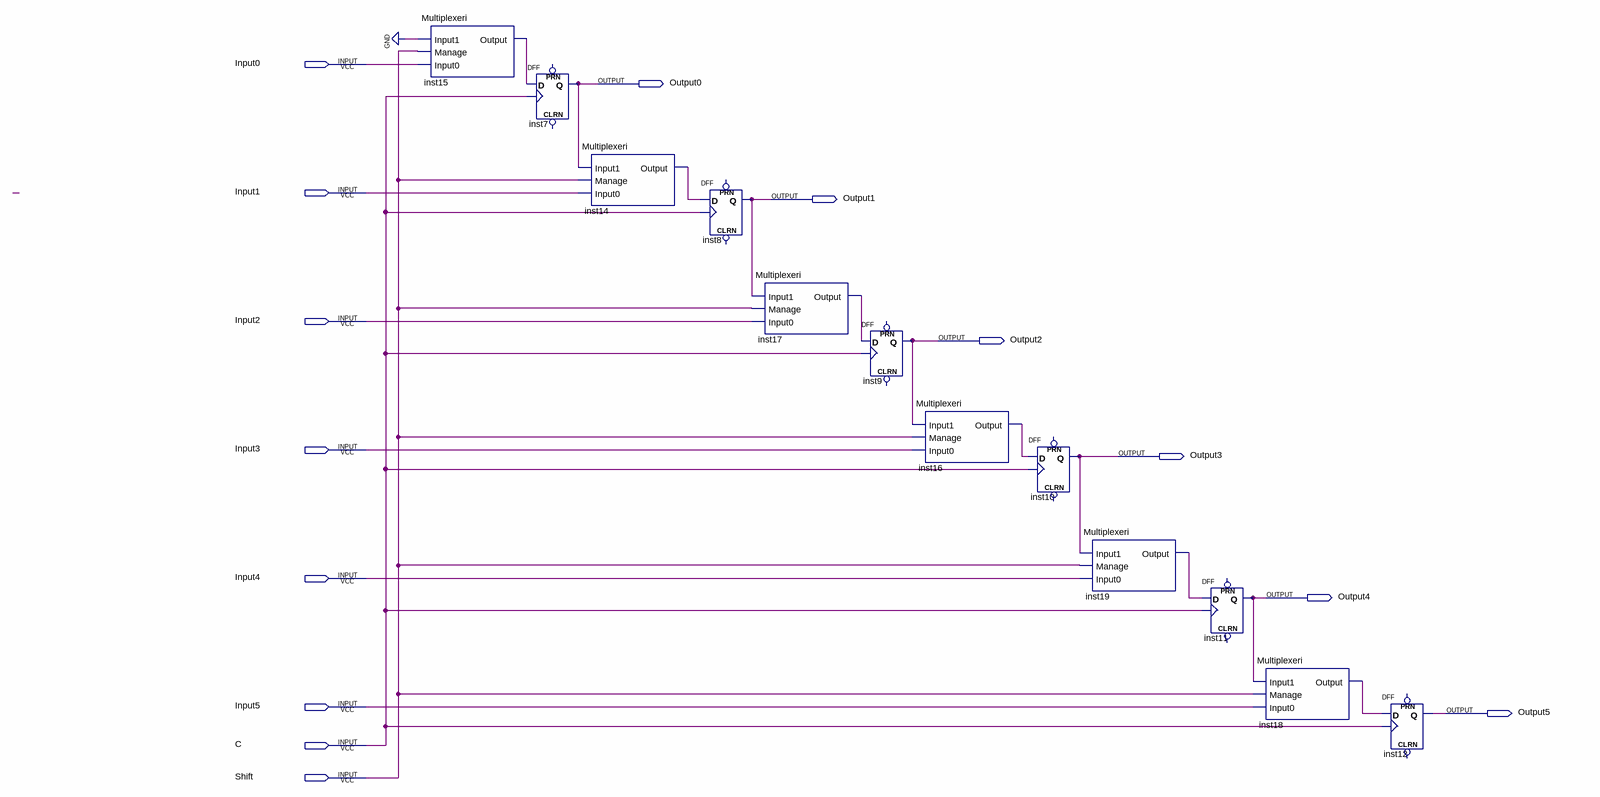
[diagram p0: schematic sheet]
// Quartus schematic Lab_1.bdf as structural Verilog: 12 symbols, 14 pins
module Lab_1 (
  input  Input0,
  input  Input1,
  input  Input2,
  input  Input3,
  input  Input4,
  input  Input5,
  input  C,
  input  Shift,
  output Output0,
  output Output1,
  output Output2,
  output Output3,
  output Output4,
  output Output5
);

  wire inst14_output, inst15_output, inst16_output, inst17_output, inst18_output, inst19_output;

  Multiplexeri inst15 (.Input1(1'b0), .Manage(Shift), .Input0(Input0), .Output(inst15_output));
  DFF inst7 (.CLK(C), .D(inst15_output), .Q(Output0));  // open: CLRN, PRN
  Multiplexeri inst14 (.Input1(Output0), .Manage(Shift), .Input0(Input1), .Output(inst14_output));
  DFF inst8 (.CLK(C), .D(inst14_output), .Q(Output1));  // open: CLRN, PRN
  Multiplexeri inst17 (.Input1(Output1), .Manage(Shift), .Input0(Input2), .Output(inst17_output));
  DFF inst9 (.CLK(C), .D(inst17_output), .Q(Output2));  // open: CLRN, PRN
  Multiplexeri inst16 (.Input1(Output2), .Manage(Shift), .Input0(Input3), .Output(inst16_output));
  DFF inst10 (.CLK(C), .D(inst16_output), .Q(Output3));  // open: CLRN, PRN
  Multiplexeri inst19 (.Input1(Output3), .Manage(Shift), .Input0(Input4), .Output(inst19_output));
  DFF inst11 (.CLK(C), .D(inst19_output), .Q(Output4));  // open: CLRN, PRN
  Multiplexeri inst18 (.Input1(Output4), .Manage(Shift), .Input0(Input5), .Output(inst18_output));
  DFF inst12 (.CLK(C), .D(inst18_output), .Q(Output5));  // open: CLRN, PRN
endmodule
